# EAGLE design main (EAGLE 7.6.0)
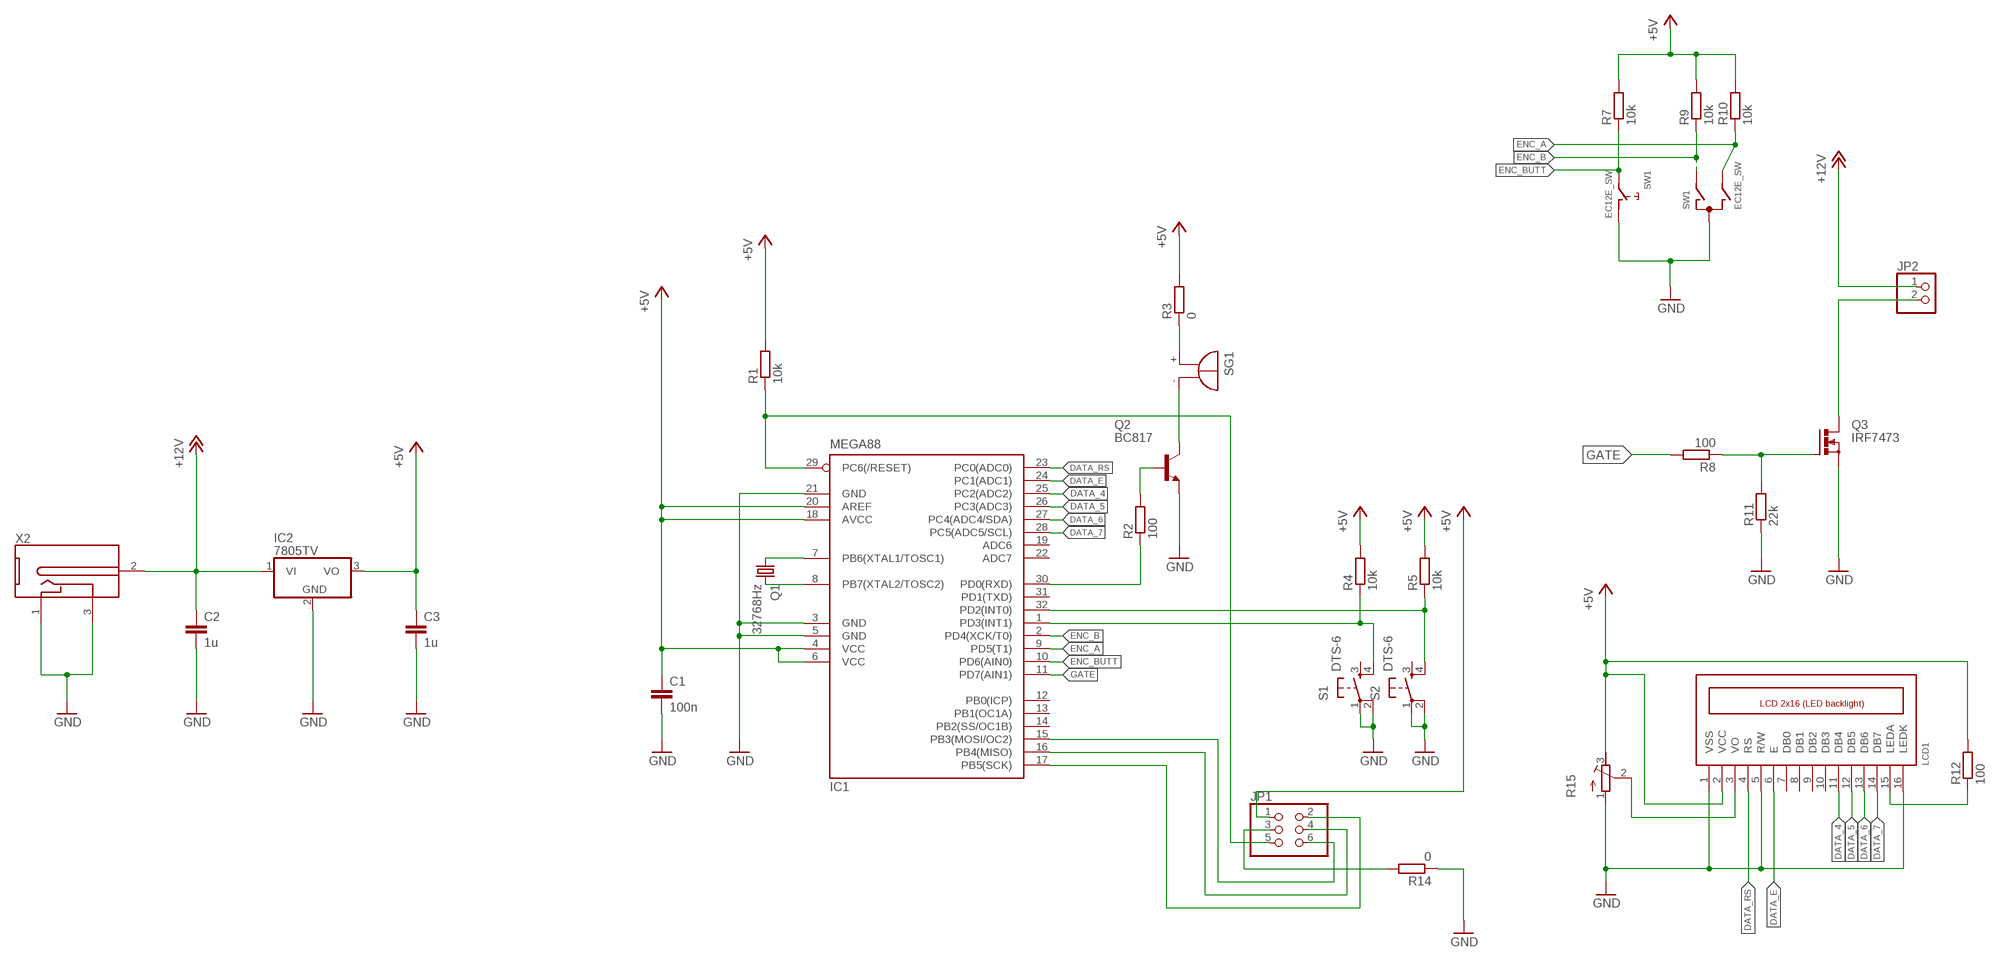
[diagram p0: schematic, sheet 1]

## Parts
C1  100n  C-EUC1206K  [C1206K]
C2  1u  C-EUC1206K  [C1206K]
C3  1u  C-EUC1206K  [C1206K]
IC1  MEGA88  MEGA8-AI  [TQFP32-08]
IC2  7805TV  [TO220V]
JP1  PINHD-2X3  [2X03]
JP2  PINHD-1X2  [1X02]
LCD1  LCD_2X16_SIL  [HY-1602F]
Q1  32768Hz  CRYSTALTC38H  [TC38H]
Q2  BC817  BC817-16LT1SMD  [SOT23-BEC]
Q3  IRF7473  N-MOSFET-SO8S  [SO-08]
R1  10k  R-EU_R1206  [R1206]
R2  100  R-EU_R1206  [R1206]
R3  0  R-EU_R1206  [R1206]
R4  10k  R-EU_R1206  [R1206]
R5  10k  R-EU_R1206  [R1206]
R7  10k  R-EU_R1206  [R1206]
R8  100  R-EU_R1206  [R1206]
R9  10k  R-EU_R1206  [R1206]
R10  10k  R-EU_R1206  [R1206]
R11  22k  R-EU_R1206  [R1206]
R12  100  R-EU_R1206  [R1206]
R14  0  R-EU_R1206  [R1206]
R15  R-TRIMM3296W  [RTRIM3296W]
S1  DTS-6  [DTS-6]
S2  DTS-6  [DTS-6]
SG1  BMT1205XH7.5  [BMT1205XH7.5]
SW1  EC12E_SW  [ALPS_EC12E_SW]
X2  DC-2.5MM-5MM  [DC-21MM]

## Nets
+5V: C1.1 C3.1 IC1.4(VCC) IC1.6(VCC) IC1.18(AVCC) IC1.20(AREF) IC2.3(VO) JP1.1 LCD1.2(VCC) R1.2 R3.2 R4.2 R5.2 R7.2 R9.2 R10.2 R12.2 R15.3(E)
+12V: C2.1 IC2.1(VI) JP2.1 X2.2
DATA_4: IC1.25(PC2(ADC2)) LCD1.11(DB4)
DATA_5: IC1.26(PC3(ADC3)) LCD1.12(DB5)
DATA_6: IC1.27(PC4(ADC4/SDA)) LCD1.13(DB6)
DATA_7: IC1.28(PC5(ADC5/SCL)) LCD1.14(DB7)
DATA_E: IC1.24(PC1(ADC1)) LCD1.6(E)
DATA_RS: IC1.23(PC0(ADC0)) LCD1.4(RS)
ENC_A: IC1.9(PD5(T1)) R10.1 SW1.B
ENC_B: IC1.2(PD4(XCK/T0)) R9.1 SW1.A
ENC_BUTT: IC1.10(PD6(AIN0)) R7.1 SW1.E(BUTT)
GATE: IC1.11(PD7(AIN1)) R8.2
GND: C1.2 C2.2 C3.2 IC1.3(GND) IC1.5(GND) IC1.21(GND) IC2.2(GND) LCD1.1(VSS) LCD1.5(R/W) LCD1.16(LEDK) Q2.E Q3.1(S) Q3.2(S) Q3.3(S) R11.1 R14.1 R15.1(A) S1.1 S1.2 S2.1 S2.2 SW1.C SW1.GND@1(BUTT_GND) X2.1 X2.3
N$1: IC1.17(PB5(SCK)) JP1.2
N$2: JP1.3 R14.2
N$3: IC1.15(PB3(MOSI/OC2)) JP1.6
N$4: Q3.4(G) R8.1 R11.2
N$5: IC1.16(PB4(MISO)) JP1.4
N$6: IC1.29(PC6(/RESET)) JP1.5 R1.1
N$75: IC1.30(PD0(RXD)) R2.1
N$76: Q2.C SG1.-
N$77: Q2.B R2.2
N$78: R3.1 SG1.+
N$79: JP2.2 Q3.5(D) Q3.6(D) Q3.7(D) Q3.8(D)
N$220: IC1.7(PB6(XTAL1/TOSC1)) Q1.1
N$221: IC1.8(PB7(XTAL2/TOSC2)) Q1.2
N$225: IC1.32(PD2(INT0)) R5.1 S2.4
N$226: IC1.1(PD3(INT1)) R4.1 S1.4
N$227: LCD1.3(VO) R15.2(S)
N$231: LCD1.15(LEDA) R12.1
Unconnected: IC1.12(PB0(ICP)) IC1.13(PB1(OC1A)) IC1.14(PB2(SS/OC1B)) IC1.19(ADC6) IC1.22(ADC7) IC1.31(PD1(TXD)) LCD1.7(DB0) LCD1.8(DB1) LCD1.9(DB2) LCD1.10(DB3) S1.3 S2.3 SW1.GND@2(GND) SW1.GND@3(GND)

## Library data of the parts
C1-C3 = rcl:C-EU: CAPACITOR, European symbol
IC1 = atmel:MEGA8: MICROCONTROLLER 8 Kbytes FLASH, 1 kbytes SRAM, 512 bytes EEPROM, USART, 6-channel 10 bit ADC, 2-channel 8 bit ADC Pin compatible with Atmega48, ATMega88, ATMega168 Source: avr.lbr; MPN: ATMEGA8-16AU; OC_FARNELL: 9171371; OC_NEWARK: 73M8863
IC2 = linear:78*: Positive VOLTAGE REGULATOR Source: http://cache.national.com/ds/LM/LM78L05.pdf http://www.fairchildsemi.com/ds/LM/LM7805.pdf
JP1 = pinhead:PINHD-2X3: PIN HEADER
JP2 = pinhead:PINHD-1X2: PIN HEADER
LCD1 = lcd_2x16_led_backlight:LCD_2X16_SIL
Q1 = crystal:CRYSTAL: CRYSTAL; OC_FARNELL: unknown; OC_NEWARK: unknown
Q2 = transistor-npn:BC817*: NPN Transistor
Q3 = transistor-power:N-MOSFET-SO8: N-Channel MOSFET Example: FDS7760A; N-Channel Logic Level PowerTrench® MOSFET FDS2572; N-Channel UltraFET® Trench MOSFET Source: www.fairchildsemi.com
R1-R5 R7-R12 R14 = rcl:R-EU_: RESISTOR, European symbol
R15 = rcl:R-TRIMM: Trimm resistor
S1 S2 = switch-tact:DTS-6
SG1 = buzzer:BMT1205XH7.5: MAGNETIC TRANSDUCER Source: Http:www.be-star.com; OC_FARNELL: unknown; OC_NEWARK: unknown
SW1 = switch-alps:EC12E_SW: ALPS rotary Encoder EC12E series with switch; MPN: EC12E2424407; OC_FARNELL: 1520813; OC_NEWARK: 74M1068
X2 = power-jack:DC: 5mm x 2.1mm jack

## Board
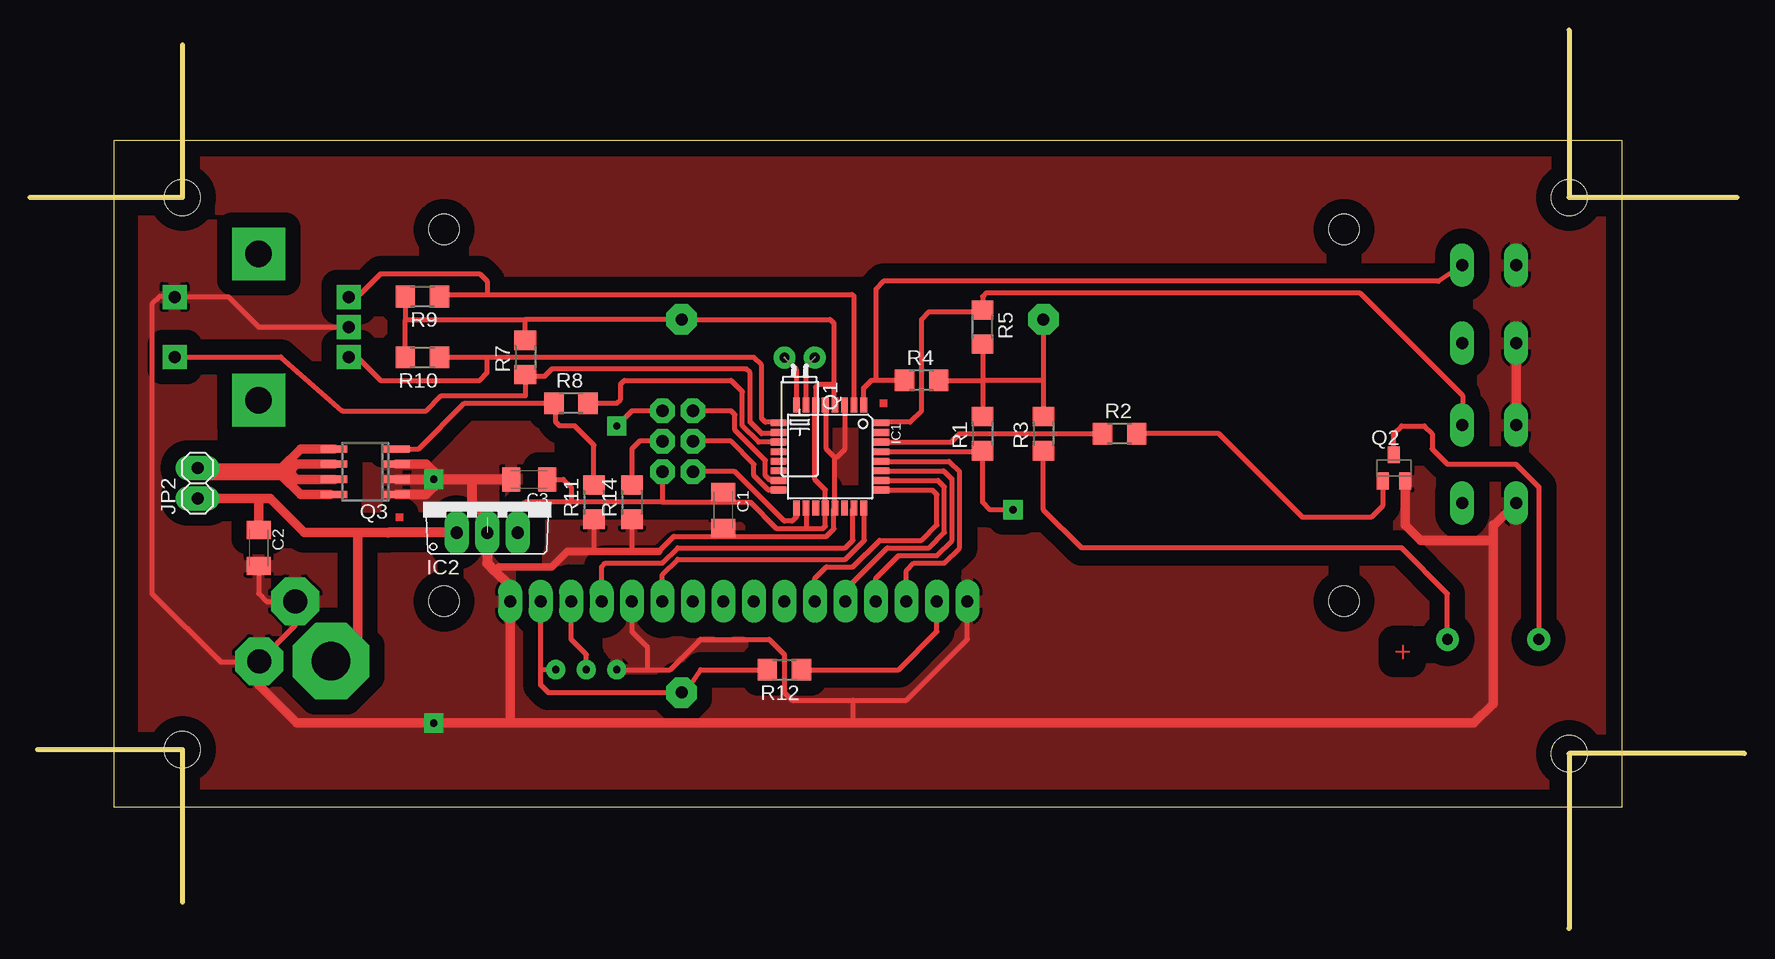
[diagram p1: board, top side]
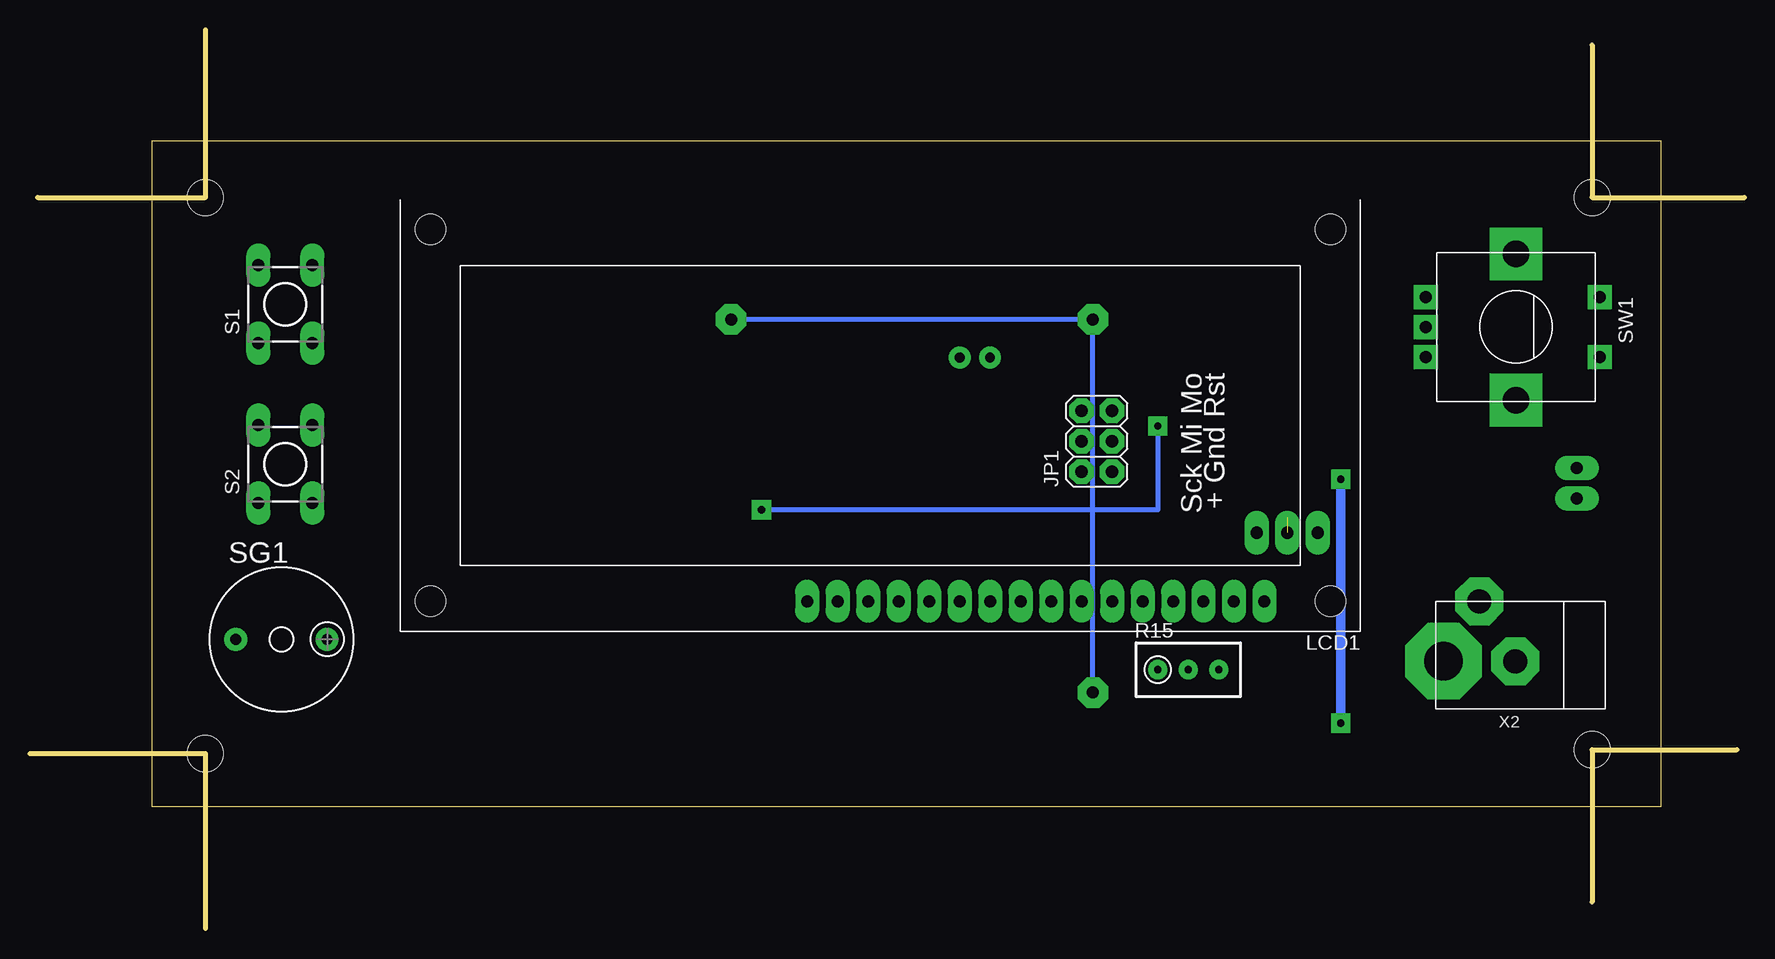
[diagram p2: board, bottom side, seen from below]

Size 142.88 x 74.93 mm. Coordinates in mm from the lower left corner, seen from the top.
Outline: 12.7,73.66 12.7,60.96 0,60.96
Outline: 128.27,74.93 128.27,60.96 142.24,60.96
Outline: 12.7,2.22 12.7,14.92 0.63,14.92
Outline: 128.27,0 128.27,14.61 142.88,14.61
Outline: 6.99,10.16 132.69,10.16 132.69,65.71 6.99,65.71 6.99,10.16
Copper layers (1*16): Top 0.035mm / dielectric 1.5mm / Bottom 0.035mm
Design rules "default *": minimum track width 0.2mm, minimum drill 0.1mm, track to track 0.2mm, track to pad 0.2mm, pad to pad 0.2mm, via to via 0.6mm, smd to smd 0.2mm, copper to edge 0.5mm, drill to drill 1.5mm, minimum pad ring 0.5mm, minimum via ring 0.5mm, stop-mask expansion 4mil, vias tented up to drill 0mil, thermal gap 10mil
Holes 3 mm at 12.7,14.92 128.27,14.61 128.27,60.96 12.7,60.96

### Footprints (pad centres in the part's own frame; a part is rotated, then mirrored left to right if it is on the bottom)
C1206K = smd 1.5 x 2: 1 -1.5,0; 2 1.5,0
TQFP32-08 = smd 1.27 x 0.559: 1 -4.293,2.8; 2 -4.293,2; 3 -4.293,1.2; 4 -4.293,0.4; 5 -4.293,-0.4; 6 -4.293,-1.2; 7 -4.293,-2; 8 -4.293,-2.8; 17 4.293,-2.8; 18 4.293,-2; 19 4.293,-1.2; 20 4.293,-0.4; 21 4.293,0.4; 22 4.293,1.2; 23 4.293,2; 24 4.293,2.8 | smd 0.559 x 1.27: 9 -2.8,-4.293; 10 -2,-4.293; 11 -1.2,-4.293; 12 -0.4,-4.293; 13 0.4,-4.293; 14 1.2,-4.293; 15 2,-4.293; 16 2.8,-4.293; 25 2.8,4.293; 26 2,4.293; 27 1.2,4.293; 28 0.4,4.293; 29 -0.4,4.293; 30 -1.2,4.293; 31 -2,4.293; 32 -2.8,4.293
TO220V = drill 1.016 long: 1 -2.54,-2.54; 2 0,-2.54; 3 2.54,-2.54
2X03 = drill 1.016 octagon: 1 -2.54,-1.27; 2 -2.54,1.27; 3 0,-1.27; 4 0,1.27; 5 2.54,-1.27; 6 2.54,1.27
1X02 = drill 1.016 long: 1 -1.27,0; 2 1.27,0
HY-1602F = drill 1 pad 1.93 long: 1 2.54,0; 2 5.08,0; 3 7.62,0; 4 10.16,0; 5 12.7,0; 6 15.24,0; 7 17.78,0; 8 20.32,0; 9 22.86,0; 10 25.4,0; 11 27.94,0; 12 30.48,0; 13 33.02,0; 14 35.56,0; 15 38.1,0; 16 40.64,0 | hole 2.5: -2.96,0; 72.04,0; -2.96,-31; 72.04,-31
TC38H = drill 0.813: 1 -1.27,0; 2 1.27,0
SOT23-BEC = smd 1 x 1.4: B -0.95,-1.1; C 0,1.1; E 0.95,-1.1
SO-08 = smd 0.6 x 2.2: 1 -1.905,-2.6; 2 -0.635,-2.6; 3 0.635,-2.6; 4 1.905,-2.6; 5 1.905,2.6; 6 0.635,2.6; 7 -0.635,2.6; 8 -1.905,2.6
R1206 = smd 1.6 x 1.803: 1 -1.422,0; 2 1.422,0
RTRIM3296W = drill 0.61: 1 0,-2.54; 2 0,0; 3 0,2.54
DTS-6 = drill 1 long: 1 -3.25,2.25; 2 3.25,2.25; 3 -3.25,-2.25; 4 3.25,-2.25
BMT1205XH7.5 = drill 0.9 pad 1.5: + 3.8,0; - -3.8,0
ALPS_EC12E_SW = drill 1 square: A -2.5,-7.5; B 2.5,-7.5; C 0,-7.5; E 2.5,7; GND@1 -2.5,7 | drill 2.2 square: GND@2 -6.1,0; GND@3 6.1,0
DC-21MM = drill 2 pad 3.5 octagon: 1 -5.08,-3.353; 3 -0.076,-0.356 | drill 3.2 pad 4.826 octagon: 2 -0.076,-6.35

### Placement (x,y rotation side)
C1  57.78,34.92 270 top
C2  19.05,31.75 270 top
C3  41.59,37.46 180 top
IC1  66.67,39.37 270 top
IC2  38.1,35.56 0 top
JP1  53.98,40.64 90 bottom
JP2  13.97,37.15 90 top
LCD1  37.47,27.3 180 bottom
Q1  64.14,47.62 180 top
Q2  113.67,38.42 0 top
Q3  27.94,38.1 90 top
R1  79.38,41.27 90 top
R2  90.81,41.27 0 top
R3  84.46,41.27 90 top
R4  74.3,45.72 0 top
R5  79.38,50.16 270 top
R7  41.27,47.62 90 top
R8  45.09,43.81 0 top
R9  32.7,52.7 180 top
R10  32.7,47.62 180 top
R11  46.99,35.56 90 top
R12  62.87,21.59 180 top
R14  50.16,35.56 90 top
R15  46.35,21.59 270 bottom
S1  121.6,52.07 90 bottom
S2  121.6,38.73 90 bottom
SG1  121.92,24.13 0 bottom
SW1  19.05,50.16 270 bottom
X2  18.73,22.23 270 bottom

### Tracks (layer width: path | path; a pad name or v marks a point on that pad's centre or on a via)
+5V  (via drill 1 pad 2.54)
  Top 0.4: IC1.6 65.48,43.57 | IC1.6 65.41,43.59 65.41,37.46 66.28,36.59 IC1.20 66.28,33.57 66.04,33.34 64.77,33.34 | 64.77,33.34 62.23,33.34 60.01,35.56 57.78,35.56 | 64.77,33.34 64.67,33.43 IC1.18 | 57.78,35.56 52.7,35.56 JP1.1 | 42.55,20.32 43.18,19.68 v54.29,19.68 54.61,19.68 55.88,21.59 R12.2 61.59,21.59 | 31.28,50.8 41.27,50.8 | 66.99,45.4 66.99,43.74 IC1.4 | 66.99,45.4 65.72,45.4 65.48,45.16 IC1.6 | 66.99,45.4 66.99,50.48 66.67,50.8 v54.29,50.8 41.27,50.8 | 84.46,45.72 79.38,45.72 | R7.2 41.27,50.8 | R9.2 31.28,50.8 | R10.2 31.28,50.8 | R5.2 79.38,45.72 | 79.38,45.72 R1.2 | R4.2 79.38,45.72 | C1.1 57.78,35.56 | v84.46,50.8 84.46,45.72 | 84.46,45.72 R3.2
  Top 0.406: 52.7,35.56 45.09,35.56 | 45.09,35.56 41.27,35.56 40.64,34.92 IC2.3 | C3.1 44.45,37.46 45.09,36.83 45.09,35.56 | 42.55,20.32 42.55,21.59 | 42.55,21.59 LCD1.2 | R15.3 42.55,21.59
  Bottom 0.4: v84.46,50.8 v54.29,50.8 v54.29,19.68
+12V
  Top 0.8: 27.3,33.02 22.86,33.02 20,35.88 19.05,35.88 | 27.3,33.02 29.84,33.02 | JP2.1 19.05,35.88 | C2.1 19.05,35.88 | X2.2 25.48,22.3 27.3,24.13 27.3,33.02
  Top 0.813: IC2.1 29.84,33.02
DATA_4
  Top 0.4: LCD1.11 65.41,29.21 66.36,30.16 68.58,30.16 70.8,32.38 74.3,32.38 75.57,33.66 75.57,36.2 75.19,36.57 IC1.25
DATA_5
  Top 0.4: LCD1.12 67.95,28.26 71.44,31.75 74.93,31.75 76.2,33.02 76.2,36.83 75.66,37.37 IC1.26
DATA_6
  Top 0.4: LCD1.13 70.48,29.21 72.39,31.12 75.57,31.12 76.84,32.38 76.84,37.46 76.13,38.17 IC1.27
DATA_7
  Top 0.4: LCD1.14 73.03,29.84 73.66,30.48 76.2,30.48 77.47,31.75 77.47,38.1 76.6,38.97 IC1.28
DATA_E
  Top 0.4: LCD1.6 52.7,29.53 53.98,30.8 67.95,30.8 69.53,32.38 69.53,35.02 IC1.24
DATA_RS
  Top 0.4: LCD1.4 47.62,30.16 47.94,30.48 52.7,30.48 53.98,31.75 67.95,31.75 68.58,32.38 68.58,34.98 IC1.23
ENC_A
  Top 0.4: IC1.9 62.32,42.23 61.28,42.23 60.96,42.55 60.96,46.99 60.32,47.62 38.1,47.62 | 38.1,47.62 R10.1 | SW1.B 27.27,47.66 29.21,45.72 37.47,45.72 38.1,46.35 38.1,47.62
ENC_B
  Top 0.4: IC1.2 68.67,52.7 68.51,52.87 38.1,52.87 | R9.1 34.29,52.87 38.1,52.87 | SW1.A 27.27,52.66 29.21,54.61 37.47,54.61 38.1,53.97 38.1,52.87
ENC_BUTT
  Top 0.4: SW1.E 20.91,47.66 26.04,43.18 33.02,43.18 34.29,44.45 41.27,44.45 R7.1 41.44,46.04 42.86,46.04 43.5,46.67 59.69,46.67 60.01,46.35 60.01,42.23 60.96,41.27 62.29,41.27 IC1.10
GATE
  Top 0.4: R8.2 48.89,43.81 49.21,44.13 49.21,45.4 49.53,45.72 58.42,45.72 59.37,44.77 59.37,41.91 60.71,40.57 IC1.11
GND  (via drill 0.6)  (1 unrouted)
  Top 0.4: 12.07,52.7 10.79,52.7 10.16,52.07 10.16,27.94 15.88,22.23 19.01,22.23 X2.3 22.09,25.3 X2.1 19.69,27.3 19.05,27.94 C2.2 | SW1.C 19.05,50.16 16.55,52.66 SW1.GND@1 12.01,52.7 | 58.42,32.7 53.66,32.7 52.39,31.43 | 58.42,32.7 66.36,32.7 66.99,33.34 66.99,34.99 IC1.21 67.08,39.29 | 67.08,39.29 66.36,40.01 66.36,43.58 IC1.5 | 67.08,39.29 67.23,39.29 67.88,39.94 IC1.3 | R11.1 46.99,31.43 | LCD1.5 50.16,24.77 51.43,23.49 51.43,21.74 | 53.34,21.59 55.88,24.13 61.59,24.13 62.87,22.86 62.87,19.68 63.5,19.05 68.58,19.05 | 68.58,19.05 73.03,19.05 78.11,24.13 78.11,27.94 | 68.58,19.05 68.58,17.14 | C1.2 58.42,32.7 | R14.1 50.16,31.43
  Top 0.406: R15.1 53.34,21.59
  Top 0.61: 52.39,31.43 50.16,31.43 46.99,31.43 44.77,31.43 43.5,30.16 39.05,30.16 38.73,29.84
  Top 0.8: 40.01,17.14 LCD1.1 | Q3.2 v33.66,37.46 | Q3.1 33.02,36.2 33.66,36.83 v33.66,37.46 | Q3.3 33.02,38.73 33.66,38.1 v33.66,37.46 | 40.01,17.14 v33.66,17.14 22.23,17.14 19.05,20.32 19.05,22.26 X2.3 | 40.01,17.14 68.58,17.14 120.33,17.14 121.92,18.73 121.92,32.38 | Q2.E 114.62,33.66 115.89,32.38 121.92,32.38 | 121.92,32.38 121.92,33.66 122.02,33.66 S2.1 | S1.1 S2.2
  Top 0.813: 40.01,37.46 36.83,37.46 | 36.83,37.46 v33.66,37.46 | 36.83,37.46 36.83,35.56 38.1,34.29 38.1,30.48 38.73,29.84 40.01,28.58 LCD1.1
  Bottom 0.8: v33.66,37.46 v33.66,17.14
  pour Top (isolate 1.27): 9.53,64.14 130.81,64.14 130.81,12.06 9.53,12.06
N$1
  Top 0.4: IC1.17 63.88,34.35 63.5,33.97 62.87,33.97 58.74,38.1 JP1.2
N$2
  Top 0.4: JP1.3 50.8,40.64 50.16,40.01 R14.2
N$3
  Top 0.4: IC1.15 61.69,37.37 61.28,37.78 61.28,39.05 58.74,41.59 58.74,42.86 58.42,43.18 JP1.6
N$4
  Top 0.4: Q3.4 32.38,40.01 36.2,43.81 R8.1 43.81,43.66 43.81,42.23 44.13,41.91 45.4,41.91 46.99,40.32 R11.2
N$5
  Top 0.4: IC1.16 61.54,36.57 60.32,37.78 60.32,38.73 58.42,40.64 JP1.4
N$6  (via drill 0.6)
  Top 0.4: IC1.29 79.29,39.77 R1.1 79.38,35.56 80.01,34.92 v81.92,34.92 | JP1.5 50.16,43.18 v48.89,41.91
  Bottom 0.4: v48.89,41.91 48.89,34.92 v81.92,34.92
N$75
  Top 0.4: IC1.30 76.77,40.57 77.47,41.27 R2.1
N$76
  Top 0.4: Q2.C 113.67,41.27 114.3,41.91 116.21,41.91 116.84,41.27 116.84,40.01 118.11,38.73 123.83,38.73 125.73,36.83 125.73,24.14 SG1.-
N$77
  Top 0.4: Q2.B 112.72,35.24 111.76,34.29 106.05,34.29 99.06,41.27 R2.2
N$78
  Top 0.4: SG1.+ 118.12,27.93 114.3,31.75 87.63,31.75 84.46,34.92 R3.1
N$79
  Top 0.4: 25.08,36.2 Q3.8
  Top 0.8: 20.95,38.42 21.91,38.42 22.23,38.73 Q3.6 25.4,38.73 | 20.95,38.42 JP2.2 14.61,37.78 20.95,37.78 | 20.95,37.78 21.91,37.78 22.23,37.46 Q3.7 25.4,37.46 | 25.08,36.2 22.54,36.2 20.95,37.78 | Q3.5 22.54,40.01 20.95,38.42
N$220
  Top 0.4: IC1.7 64.67,46.89 Q1.1
N$221
  Top 0.4: IC1.8 63.88,46.61 Q1.2
N$225
  Top 0.4: IC1.32 71.03,42.23 73.34,42.23 74.3,43.18 74.3,50.8 74.93,51.43 79.22,51.43 R5.1 79.38,52.7 79.69,53.02 110.81,53.02 119.38,44.45 119.38,42.01 S2.4
N$226
  Top 0.4: IC1.1 69.48,45.09 70.11,45.72 70.48,45.72 | 70.48,45.72 70.48,53.34 71.12,53.97 117.37,53.97 S1.4 | R4.1 70.48,45.72
N$227
  Top 0.406: R15.2 46.35,22.86 45.09,24.13 LCD1.3
N$231
  Top 0.4: LCD1.15 75.57,24.77 72.39,21.59 R12.1
(copper drawn outside any net)
  shapes: Top area x2

### Text on the board
Top: +
bNames: + Gnd Rst | Sck Mi Mo